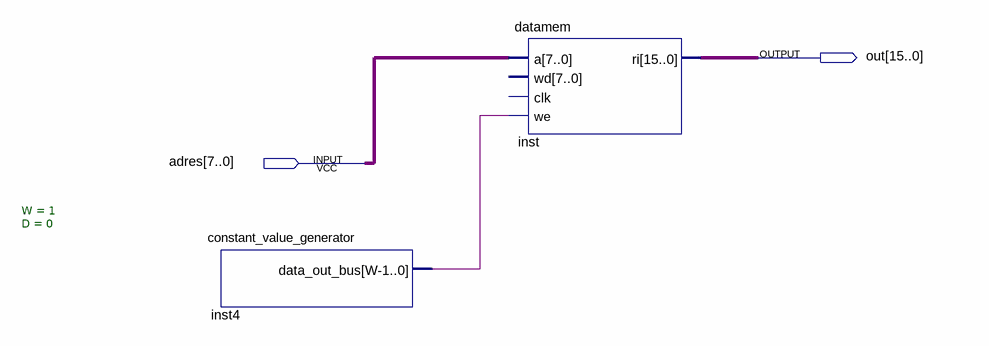
[diagram p0: schematic sheet]
// Quartus schematic datamemsematest.bdf as structural Verilog: 2 symbols, 2 pins
module datamemsematest (
  input  [7:0] adres,
  output [15:0] out
);

  wire inst4_data_out_bus;

  constant_value_generator #(.W(1), .D(0)) inst4 (.data_out_bus(inst4_data_out_bus));
  datamem inst (.a(adres), .we(inst4_data_out_bus), .ri(out));  // open: wd, clk
endmodule
